# EAGLE design pentatonic (EAGLE 6.2)
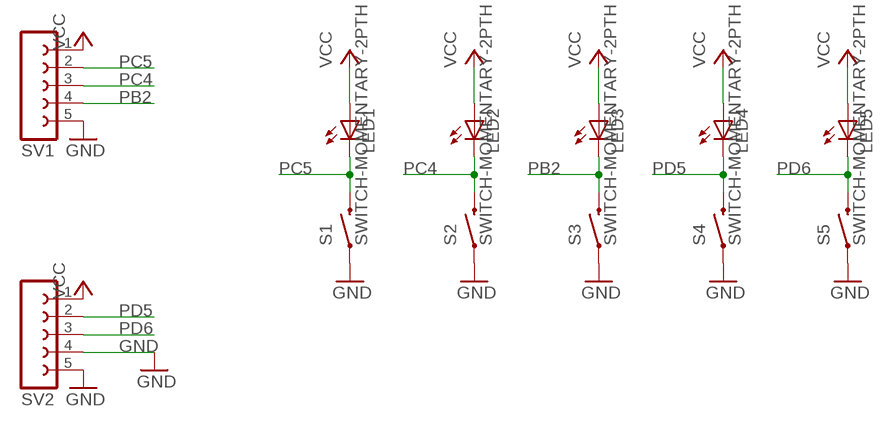
[diagram p0: schematic, sheet 1]

## Parts
LED1  LED5MM  [LED5MM]
LED2  LED5MM  [LED5MM]
LED3  LED5MM  [LED5MM]
LED4  LED5MM  [LED5MM]
LED5  LED5MM  [LED5MM]
S1  SWITCH-MOMENTARY-2PTH  [TACTILE-PTH]
S2  SWITCH-MOMENTARY-2PTH  [TACTILE-PTH]
S3  SWITCH-MOMENTARY-2PTH  [TACTILE-PTH]
S4  SWITCH-MOMENTARY-2PTH  [TACTILE-PTH]
S5  SWITCH-MOMENTARY-2PTH  [TACTILE-PTH]
SV1  FE05-1  [FE05-1]
SV2  FE05-1  [FE05-1]

## Nets
GND: S1.1 S2.1 S3.1 S4.1 S5.1 SV1.5 SV2.4 SV2.5
PB2: LED3.K(C) S3.3 SV1.4
PC4: LED2.K(C) S2.3 SV1.3
PC5: LED1.K(C) S1.3 SV1.2
PD5: LED4.K(C) S4.3 SV2.2
PD6: LED5.K(C) S5.3 SV2.3
VCC: LED1.A LED2.A LED3.A LED4.A LED5.A SV1.1 SV2.1

## Library data of the parts
LED1-LED5 = SparkFun:LED: LEDs Standard schematic elements and footprints for 5mm, 3mm, 1206, and 0603 sized LEDs. 5mm - Spark Fun Electronics SKU : COM-00529 (and others)
S1-S5 = SparkFun:SWITCH-MOMENTARY-2
SV1 SV2 = con-lsta:FE05-1: FEMALE HEADER; OC_FARNELL: unknown; OC_NEWARK: unknown

## Board
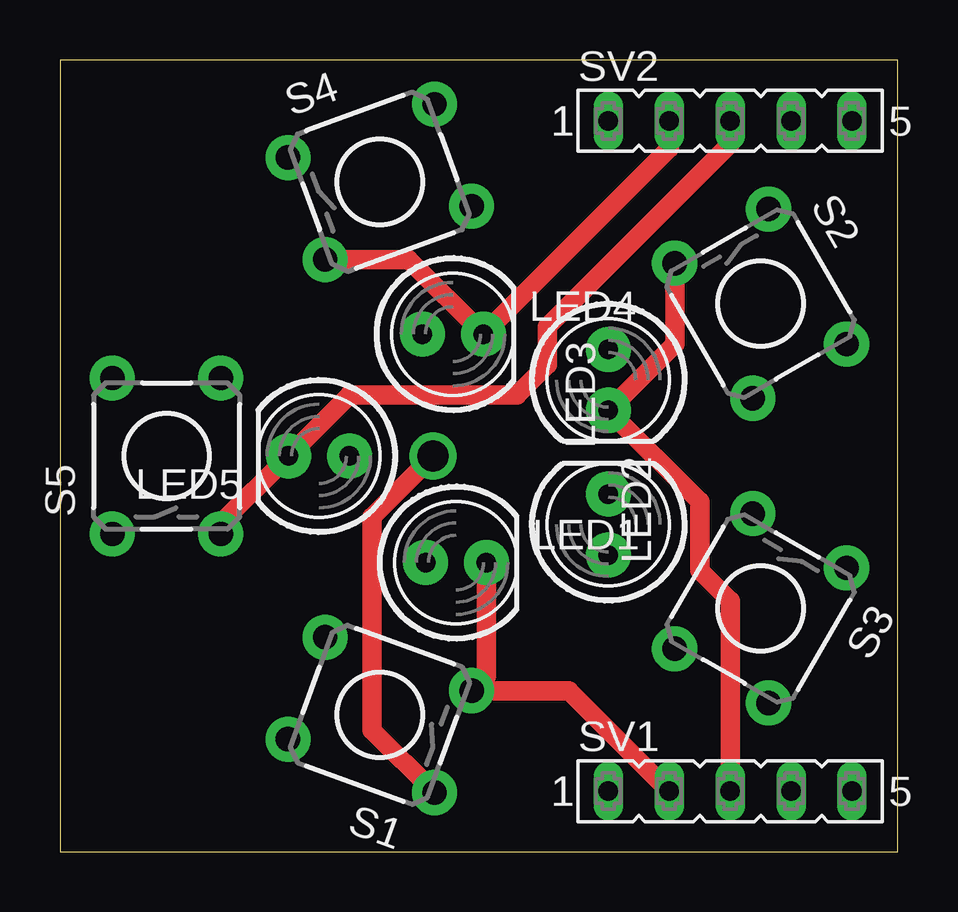
[diagram p1: board, top side]
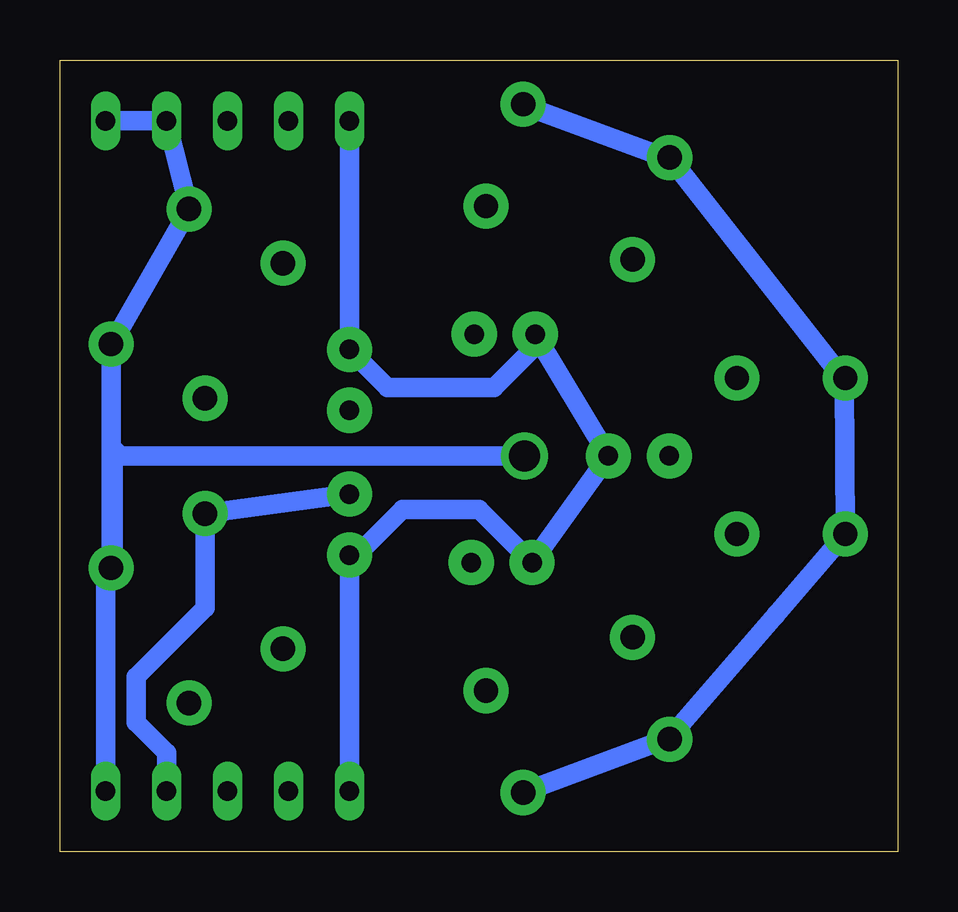
[diagram p2: board, bottom side, seen from below]

Size 34.92 x 33.02 mm. Coordinates in mm from the lower left corner, seen from the top.
Outline: 0,0 34.92,0 34.92,33.02 0,33.02 0,0
Copper layers (1*16): Top 0.0356mm / dielectric 1.5011mm / Bottom 0.0356mm
Design rules: minimum track width 6mil, minimum drill 13mil, track to track 6mil, track to pad 6mil, pad to pad 6mil, via to via 6mil, smd to smd 6mil, copper to edge 15mil, drill to drill 6mil, minimum pad ring 7mil, minimum via ring 7mil, stop-mask expansion 4mil, vias tented up to drill 0mil, thermal gap 10mil

### Footprints (pad centres in the part's own frame; a part is rotated, then mirrored left to right if it is on the bottom)
LED5MM = drill 0.813 pad 1.88: A -1.27,0; K 1.27,0
TACTILE-PTH = drill 1.016 pad 1.88: 1 -3.251,2.261; 2 3.251,2.261; 3 -3.251,-2.261; 4 3.251,-2.261
FE05-1 = drill 0.813 long: 1 -5.08,0; 2 -2.54,0; 3 0,0; 4 2.54,0; 5 5.08,0

### Placement (x,y rotation side)
LED1  16.51,12.06 0 top
LED2  22.86,19.68 270 top
LED3  22.86,13.65 90 top
LED4  16.38,21.59 0 top
LED5  10.79,16.51 180 top
S1  13.34,5.71 160 top
S2  29.21,22.86 300 top
S3  29.21,10.16 240 top
S4  13.34,27.94 20 top
S5  4.45,16.51 90 top
SV1  27.94,2.54 0 top
SV2  27.94,30.48 0 top

### Tracks (layer width: path | path; a pad name or v marks a point on that pad's centre or on a via)
GND  (via drill 1.3 pad 1.68)
  Top 0.813: v15.56,16.51 13.02,13.97 13.02,5.08 S1.1
  Bottom 0.813: SV2.5 SV2.4 S2.1 32.7,21.27 32.79,21.18 S3.1 33.02,11.62 SV1.5 33.02,11.75 32.7,12.06 32.7,16.83 32.38,16.51 v15.56,16.51 | S1.1 9.53,4.76 5.09,9.89 S5.1 2.22,19.68 S4.1
N$1
  Bottom 0.813: 9.53,28.89 15.56,31.11
PB2
  Bottom 0.813: LED3.K S3.3 28.88,10.18 31.75,7.3 31.75,5.4 30.48,4.13 SV1.4
PC4
  Top 0.813: SV1.3 27.94,10.48 26.67,11.75 26.67,14.61 LED2.K 25.63,21.18 S2.3
PC5
  Top 0.813: SV1.2 21.21,6.73 S1.3 17.78,7.34 LED1.K
PD5
  Top 0.813: SV2.2 25.4,29.34 LED4.K 14.54,24.7 S4.3
PD6
  Top 0.813: SV2.3 27.94,29.53 20.32,21.91 20.32,20.32 19.05,19.05 12.06,19.05 LED5.K 6.71,13.69 S5.3
VCC
  Bottom 0.813: SV1.1 LED3.A 22.54,12.38 20.64,14.29 17.46,14.29 LED1.A LED5.A LED4.A 15.11,21.08 16.83,19.37 21.27,19.37 LED2.A SV2.1